# Altium schematic sheet POTENCIA.SchDoc: GESTIÓN DE POTENCIA
size A3; ApprovedBy: ---; Author: MARIO DE MIGUEL; SheetNumber: 3; SheetTotal: 7; ProjectTitle: SENSACIONAL 2
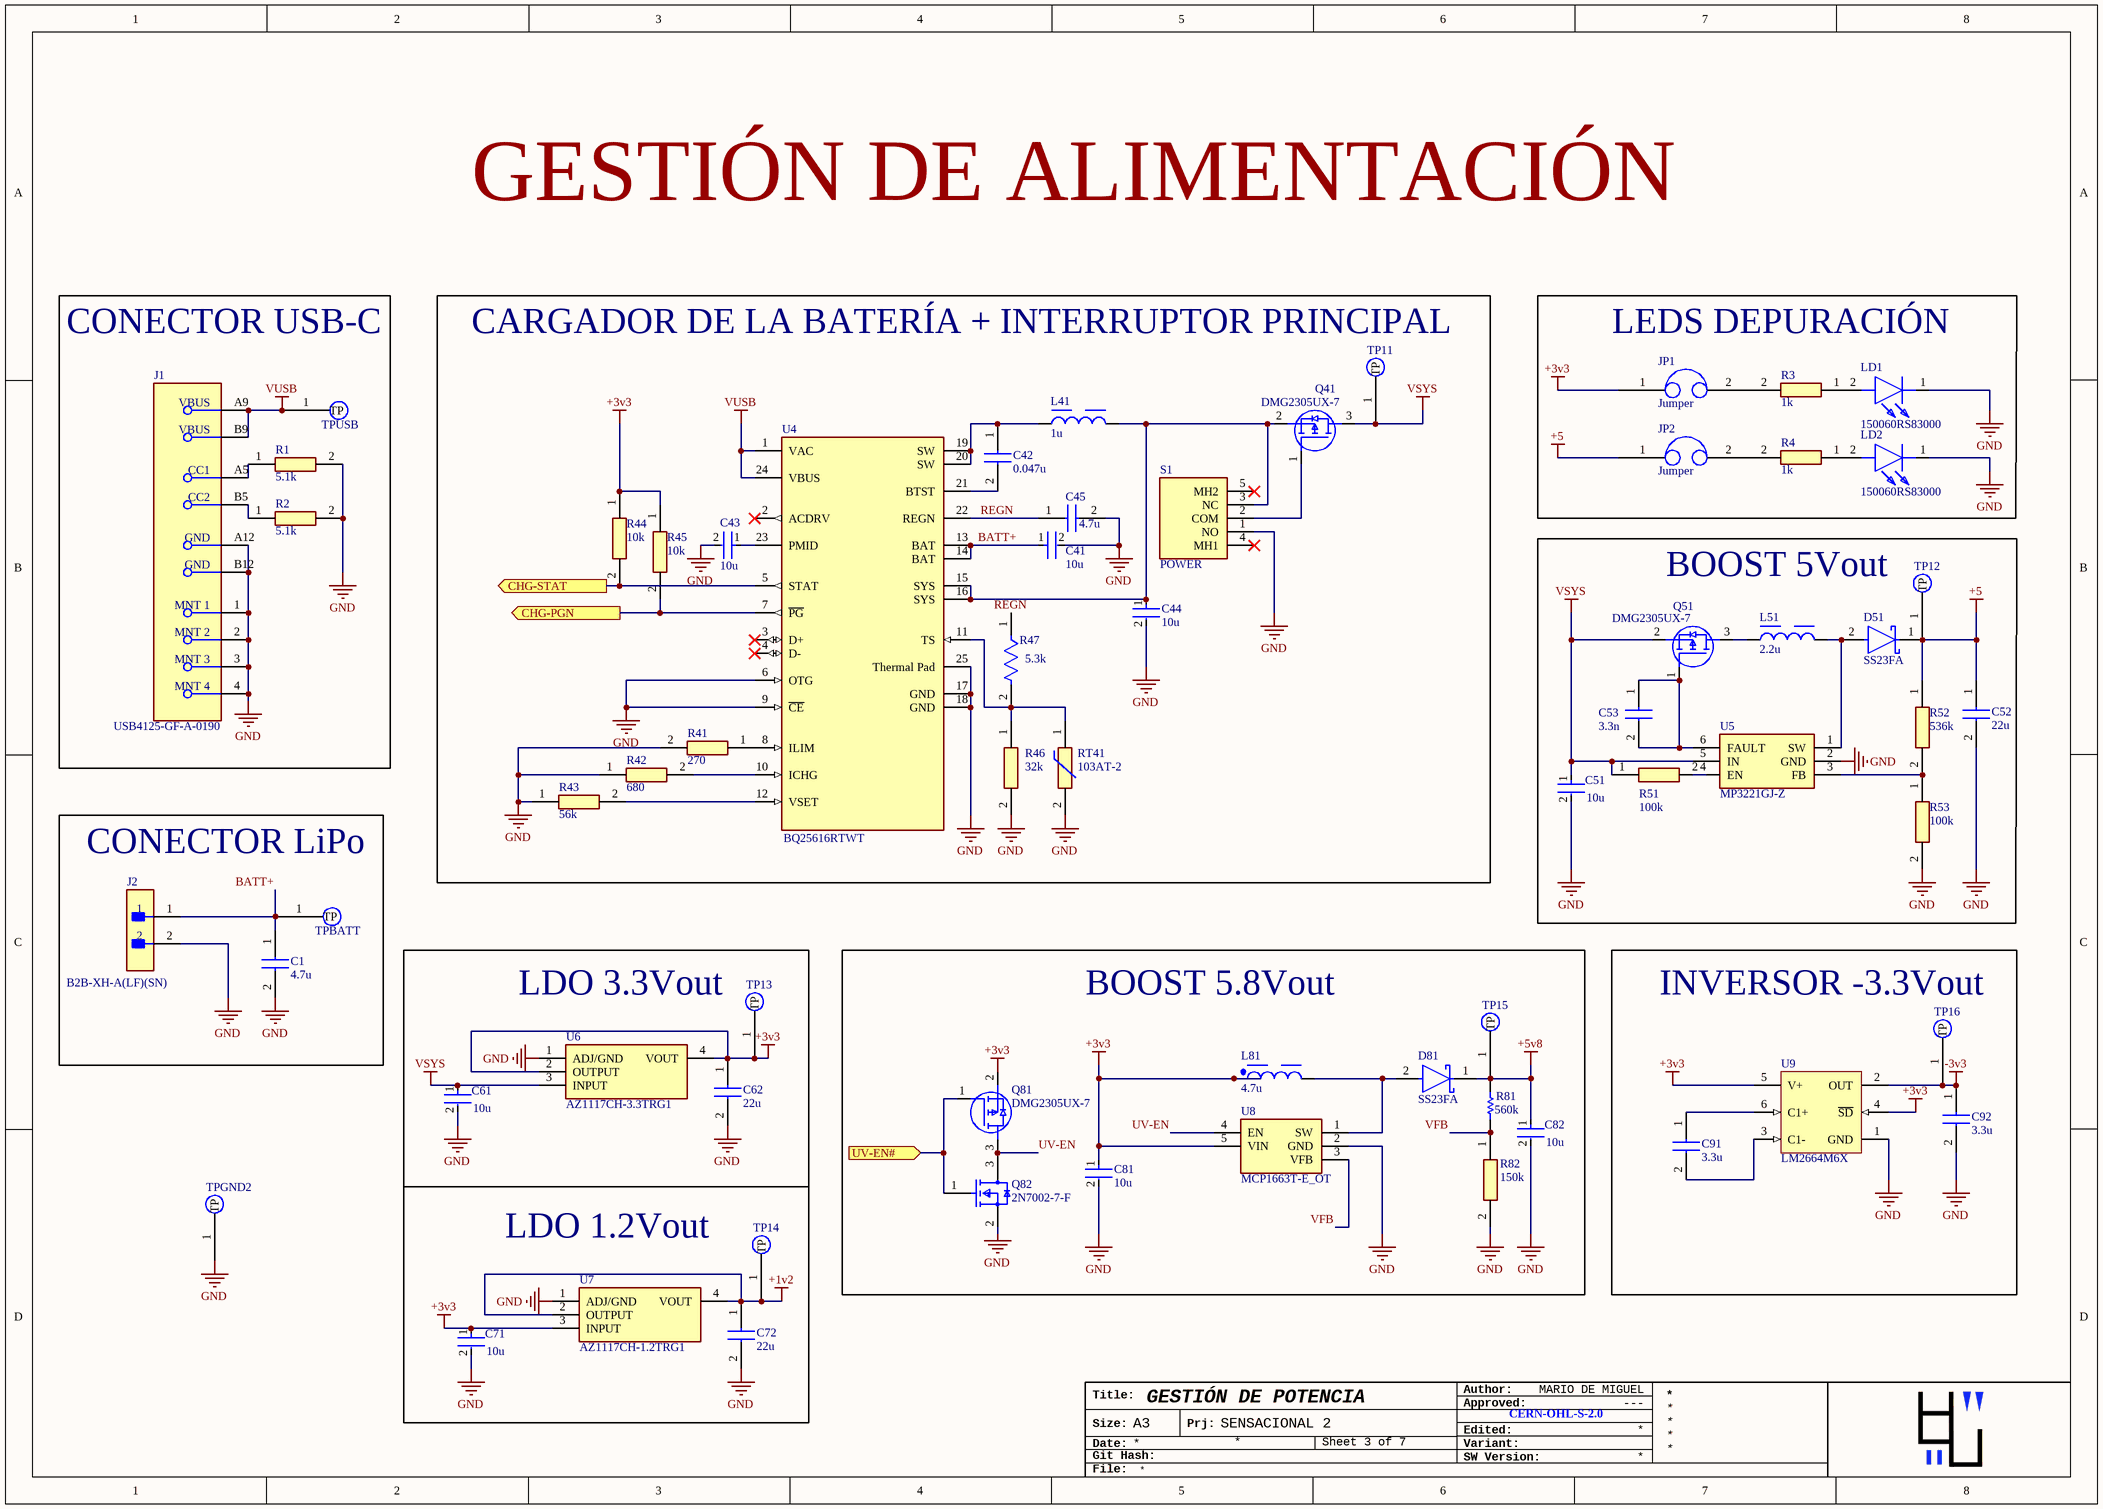
[diagram p0: POTENCIA.SchDoc]

## Parts
C1  4.7u  [C0805]
C41  10u  [FP-C2012-125-0_2-MFG]
C42  0.047u  [CAPC1608X89N]
C43  10u  [FP-C2012-125-0_2-MFG]
C44  10u  [FP-C2012-125-0_2-MFG]
C45  4.7u  [C0805]
C51  10u  [FP-C2012-125-0_2-MFG]
C52  22u  [CAPC3216X200N]
C53  3.3n  [CAPC2012X130N]
C61  10u  [FP-C2012-125-0_2-MFG]
C62  22u  [CAPC3216X200N]
C71  10u  [FP-C2012-125-0_2-MFG]
C72  22u  [CAPC3216X200N]
C81  10u  [FP-C2012-125-0_2-MFG]
C82  10u  [FP-C2012-125-0_2-MFG]
C91  3.3u  [CAPC1608X80N]
C92  3.3u  [CAPC1608X80N]
D51  SS23FA  [FP-425AB-MFG]
D81  SS23FA  [FP-425AB-MFG]
J1  USB4125-GF-A-0190  [FP-USB4125-GF-A-0190-MFG]
J2  B2B-XH-A(LF)(SN)  [FP-B2B-XH-A_LF_SN-MFG]  (no BOM)
JP1  Jumper  [JUMPER_SHUNT]  (no BOM)
JP2  Jumper  [JUMPER_SHUNT]  (no BOM)
L41  1u  [WE-MAPI_3015]
L51  2.2u  [WE-LHMI_4012]
L81  4.7u  [WE-PD_7332]
LD1  150060RS83000  [LEDC1608X95N]
LD2  150060RS83000  [LEDC1608X95N]
Q41  DMG2305UX-7  [SOT96P240X115-3N]
Q51  DMG2305UX-7  [SOT96P240X115-3N]
Q81  DMG2305UX-7  [SOT96P240X115-3N]
Q82  2N7002-7-F  [FP-SOT23-MFG]
R1  5.1k  [RESC1608X55N]
R2  5.1k  [RESC1608X55N]
R3  1k  [ERA6AEB101V]
R4  1k  [ERA6AEB101V]
R41  270  [ERA3AEB101V]
R42  680  [RESC1608X55N]
R43  56k  [ERA3AEB101V]
R44  10k  [RESC1005X40N]
R45  10k  [RESC1005X40N]
R46  32k  [RESC1608X55N]
R47  5.3k  [FP-TNPW0603-e3-MFG]
R51  100k  [ERA3AEB101V]
R52  536k  [RESC1608X55N]
R53  100k  [ERA3AEB101V]
R81  560k  [RESC1608X55X30ML15T15]
R82  150k  [RESC1608X55N]
RT41  103AT-2  [103AT2]  (no BOM)
S1  POWER  [OS102011MS2QS1]  (no BOM)
TP11  Testpoint  [Testpoint_TH]  (value not drawn)  (no BOM)
TP12  Testpoint  [Testpoint_TH]  (value not drawn)  (no BOM)
TP13  Testpoint  [Testpoint_TH]  (value not drawn)  (no BOM)
TP14  Testpoint  [Testpoint_TH]  (value not drawn)  (no BOM)
TP15  Testpoint  [Testpoint_TH]  (value not drawn)  (no BOM)
TP16  Testpoint  [Testpoint_TH]  (value not drawn)  (no BOM)
TPBATT  Testpoint  [Testpoint_TH]  (value not drawn)  (no BOM)
TPGND2  Testpoint  [Testpoint_TH]  (value not drawn)  (no BOM)
TPUSB  Testpoint  [Testpoint_TH]  (value not drawn)  (no BOM)
U4  BQ25616RTWT  [FP-RTW0024H-IPC_B]
U5  MP3221GJ-Z  [SOT95P280X100-6N]
U6  AZ1117CH-3.3TRG1  [SOT230P700X180-4N]
U7  AZ1117CH-1.2TRG1  [SOT230P700X180-4N]
U8  MCP1663T-E_OT  [SOT95P270X145-5N]
U9  LM2664M6X  [DBV0006A_N]

## Blocks framed on the sheet
CONECTOR USB-C: J1 R1 R2 TPUSB
LEDS DEPURACIÓN: JP1 JP2 LD1 LD2 R3 R4
BOOST 5Vout: C51-C53 D51 L51 Q51 R51-R53 TP12 U5
CONECTOR LiPo: C1 J2 TPBATT
LDO 3.3Vout: C61 C62 TP13 U6
BOOST 5.8Vout: C81 C82 D81 L81 Q81 Q82 R81 R82 TP15 U8
INVERSOR -3.3Vout: C91 C92 TP16 U9
LDO 1.2Vout: C71 C72 TP14 U7

## Ports
CHG-PGN (out), CHG-STAT (out), UV-EN# (in)

## Nets
+1v2: C72.1 TP14.1(TP) U7.2(OUTPUT) U7.4(VOUT)
+3v3: C62.1 C71.1 C81.1 JP1.1 L81.1 Q81.2(S) R44.1 R45.1 TP13.1(TP) U6.2(OUTPUT) U6.4(VOUT) U7.3(INPUT) U8.5(VIN) U9.4(~{SD}) U9.5(V+)
+5: C52.1 D51.1(C) JP2.1 R52.1 TP12.1(TP)
+5v8: C82.1 D81.1(C) R81.2 TP15.1(TP)
-3v3: C92.1 TP16.1(TP) U9.2(OUT)
GND: C1.2 C41.2 C43.2 C44.2 C45.2 C51.2 C52.2 C61.2 C62.2 C71.2 C72.2 C81.2 C82.2 C92.2 J1.1(MNT_1) J1.2(MNT_2) J1.3(MNT_3) J1.4(MNT_4) J1.A12(GND) J1.B12(GND) J2.2 LD1.1(K) LD2.1(K) Q82.2(S) R1.2 R2.2 R41.2 R42.1 R43.1 R46.2 R53.2 R82.2 RT41.2 S1.1(NO) TPGND2.1(TP) U4.6(OTG) U4.9(~{CE}) U4.17(GND) U4.18(GND) U4.25(Thermal_Pad) U5.2(GND) U6.1(ADJ/GND) U7.1(ADJ/GND) U8.2(GND) U9.1(GND)
VSYS: C51.1 C61.1 Q41.3(D) Q51.2(S) R51.1 TP11.1(TP) U5.5(IN) U6.3(INPUT)
VUSB: J1.A9(VBUS) J1.B9(VBUS) TPUSB.1(TP) U4.1(VAC) U4.24(VBUS)
BATT+: C1.1 C41.1 J2.1 TPBATT.1(TP) U4.13(BAT) U4.14(BAT)
CHG-PGN: R45.2 U4.7(~{PG}) ; port CHG-PGN
CHG-STAT: R44.2 U4.5(STAT) ; port CHG-STAT
REGN: C45.1 R47.1 U4.22(REGN)
UV-EN: Q81.3(D) Q82.3(D) U8.4(EN)
UV-EN#: Q81.1(G) Q82.1(G) ; port UV-EN#
VFB: R81.1 R82.1 U8.3(VFB)
NetC42_1: C42.1 L41.1 U4.19(SW) U4.20(SW)
NetC42_2: C42.2 U4.21(BTST)
NetC43_1: C43.1 U4.23(PMID)
NetC44_1: C44.1 L41.2 Q41.2(S) S1.3(NC) U4.15(SYS) U4.16(SYS)
NetC53_1: C53.1 C53.2 Q51.1(G) U5.6(FAULT)
NetC91_1: C91.1 U9.6(C1+)
NetC91_2: C91.2 U9.3(C1-)
NetD51_2: D51.2(A) L51.2 U5.1(SW)
NetD81_2: D81.2(A) L81.2 U8.1(SW)
NetJ1_A5: J1.A5(CC1) R1.1
NetJ1_B5: J1.B5(CC2) R2.1
NetJP1_2: JP1.2 R3.2
NetJP2_2: JP2.2 R4.2
NetL51_1: L51.1 Q51.3(D)
NetLD1_2: LD1.2(A) R3.1
NetLD2_2: LD2.2(A) R4.1
NetQ41_1: Q41.1(G) S1.2(COM)
NetR41_1: R41.1 U4.8(ILIM)
NetR42_2: R42.2 U4.10(ICHG)
NetR43_2: R43.2 U4.12(VSET)
NetR46_1: R46.1 R47.2 RT41.1 U4.11(TS)
NetR51_2: R51.2 U5.4(EN)
NetR52_2: R52.2 R53.1 U5.3(FB)

Not connected (* = marked no-connect by the designer): S1 4(MH1)* 5(MH2)*; U4 2(ACDRV)* 3(D+)* 4(D-)*

## Notes on the sheet
- GESTIÓN DE ALIMENTACIÓN
- CARGADOR DE LA BATERÍA + INTERRUPTOR PRINCIPAL
- Title:
- Author:
- Approved:
- Size:
- Date:
- Git Hash:
- A3
- Prj:
- SW Version:
- Variant:
- Edited:
- CERN-OHL-S-2.0
- File:

## Library data of the parts
C1 C45 = C0805X475J8RACAUTO: Capacitor; Manufacturer_Name: KEMET; Datasheet Link: https://content.kemet.com/datasheets/KEM_C1078_X7R_FT-CAP_AUTO_SMD.pdf; Height: 1.1mm; Manufacturer_Part_Number: C0805X475J8RACAUTO; Mouser Part Number: 80-C0805X475J8RAUTO; Mouser Price/Stock: https://www.mouser.co.uk/ProductDetail/KEMET/C0805X475J8RACAUTO?qs=HXFqYaX1Q2zZ0fA5cxYngw%3D%3D; Arrow Part Number: C0805X475J8RACAUTO; Arrow Price/Stock: https://www.arrow.com/en/products/c0805x475j8racauto/kemet-corporation?region=nac
C41 C43 C44 C51 C61 C71 C81 C82 = CMP-2000-05452-2: Multilayer Ceramic Capacitors 10μF ±10% 10V X7R SMD 0805; Capacitance: 10uF; Series: C; Case/Package: 0805; REACH SVHC: No SVHC; Tolerance: 10%; Resistor Type: Ceramic; Termination: SMD/SMT; Weight: 0.000194oz; Depth: 1.25mm; Construction: Flat; RoHS Compliant: Yes; Contact Plating: Tin; Packaging: Tape and Reel; Mount: Surface Mount; Thickness: 0.057inch; Radiation Hardening: No; Dielectric: X7R; Min Operating Temperature: -55°C; Voltage Rating (DC): 10V; Voltage: 10V; Width: 0.049inch; Package Quantity: 1; Number of Pins: 2; Height: 1.25mm; Max Operating Temperature: 125°C; Dielectric Material: Ceramic; Case Code (Imperial): 0805; Lead Free: Lead Free; Voltage Rating: 10V; Case Code (Metric): 2012; Length: 2mm
C42 = KAM15AR71H473KM: Capacitor; Manufacturer_Name: Kyocera AVX; Datasheet Link: https://www.mouser.com/ProductDetail/KYOCERA-AVX/KAM15AR71H473KM?qs=Jm2GQyTW%2Fbirhk%2FTN5CLyw%3D%3D; Height: 0.89mm; Manufacturer_Part_Number: KAM15AR71H473KM; Mouser Part Number: 581-KAM15AR71H473KM; Mouser Price/Stock: https://www.mouser.co.uk/ProductDetail/KYOCERA-AVX/KAM15AR71H473KM?qs=Jm2GQyTW%2Fbirhk%2FTN5CLyw%3D%3D; Arrow Part Number: KAM15AR71H473KM; Arrow Price/Stock: https://www.arrow.com/en/products/kam15ar71h473km/avx?region=nac
C52 C62 C72 = GCJ31CC71C226ME02L: Capacitor; Manufacturer_Name: Murata Electronics; Datasheet Link: https://pim.murata.com/asset/pim4/ceramicCapacitorSMD/GCJ31CC71C226ME02-01A-JP_PDF_CERAMICCAPACITORSMD?lastModifiedDatetime=20250813111307; Height: 2mm; Manufacturer_Part_Number: GCJ31CC71C226ME02L; Arrow Part Number: GCJ31CC71C226ME02L; Arrow Price/Stock: https://www.arrow.com/en/products/gcj31cc71c226me02l/murata-manufacturing?utm_currency=USD&region=nac
C53 = GRM21AR7LU332KW01D: Capacitor; Manufacturer_Name: Murata Electronics; Datasheet Link: https://search.murata.co.jp/Ceramy/image/img/A01X/G101/ENG/GRM21AR7LU332KW01-00B.pdf; Height: 1.3mm; Manufacturer_Part_Number: GRM21AR7LU332KW01D
C91 C92 = C1608X5R1V335K080AC: Capacitor; Manufacturer_Name: TDK; Datasheet Link: https://product.tdk.com/info/en/catalog/datasheets/mlcc_commercial_midvoltage_en.pdf; Height: 0.8mm; Manufacturer_Part_Number: C1608X5R1V335K080AC; Mouser Part Number: 810-C1608X5R1V335KAC; Mouser Price/Stock: https://www.mouser.co.uk/ProductDetail/TDK/C1608X5R1V335K080AC?qs=6JAMGB%252BEdkxQo4ed2qmVpg%3D%3D; Arrow Part Number: C1608X5R1V335K080AC; Arrow Price/Stock: https://www.arrow.com/en/products/c1608x5r1v335k080ac/tdk
D51 D81 = CMP-00278-84331614-1: SS23FA 2 A, 30 V Surface Mount Schottky Barrier Rectifiers; Manufacturer Lifecycle Status: ACTIVE; Max Forward Surge Current (Ifsm): 50A; Max Junction Temperature (Tj): 150°C; Max Repetitive Reverse Voltage (Vrrm): 30V; Peak Reverse Current: 400µA; Element Configuration: Single; Capacitance: 120pF; Average Rectified Current: 2A; Weight: 19mg; Max Operating Temperature: 150°C; NexarPartId: 84331614; Max Reverse Voltage (DC): 30V; Min Operating Temperature: -55°C; Packaging: Cut Tape; Schedule B: 8541100080, 8541100080; RoHS: Compliant; Reverse Voltage: 30V; Mount: Surface Mount; Height: 1.43mm; Forward Current: 2A; Lifecycle Status: Production
J1 = CMP-245163-000004-1: CONN RCPT TYPE C 6P SMD RA
J2 = CMP-2000-05888-3: CONN HEADER VERT 2POS 2.5MM; Current Rating: 3A; Voltage Rating: 250V; Number of Contacts: 2; Contact Resistance: 20mR; Wire/Cable Gauge: 22AWG; Insulation Resistance: 1GR; Connector Type: Male Pin; Packaging: Bulk; Contact Material: Brass; Lead Free: Lead Free; Orientation: Straight; Contact Plating: Tin; Max Current Rating: 3A; Termination: Solder; Fastening Type: Detent; Depth: 5.75mm; Housing Material: Polyamide; REACH SVHC: No SVHC; Series: XH; Voltage Rating (AC): 250V; Number of Positions: 2; Color: Natural; Contact Type: Male Pin; Max Voltage Rating (DC): 250V; Pitch: 2.5mm; Lead Pitch: 2.5mm; Mount: Through Hole; Max Operating Temperature: 85°C; Length: 7.4mm; Max Voltage Rating (AC): 250V; Min Operating Temperature: -25°C; Number of Rows: 1; Housing Color: White
JP1 JP2 = Shunt
L41 = CMP-1393-00020-3: NexarPartId: 30848166; Inductance Tolerance: 20%; Core Material: Composite, Ferrite, Metal; Series Resistance: 39mΩ; Test Frequency: 100kHz; RMS Current (Irms): 2.7A; Inductance: 1µH; Shielding: Shielded; Self Resonant Frequency: 72MHz; Saturation Current: 4.5A; Height: 1.5mm; Packaging: Cut Tape (CT); Ambient Temperature Range High: 85°C; DC Resistance (DCR): 39mΩ; REACH SVHC: Unknown; Case/Package: SMD/SMT; Number of Pins: 2; Case Code (Metric): 3030; Height - Seated (Max): 1.4986mm; Min Operating Temperature: -40°C; Length: 3mm; Tolerance: 20%; Depth: 3mm; Max DC Current: 2.7A; Termination: SMD/SMT; Ambient Temperature Range Low: -40°C; Case Code (Imperial): 1212; Mount: Surface Mount; Width: 3mm; Max Operating Temperature: 125°C; Current Rating: 2.7A; RoHS: Compliant
L51 = CMP-03913-52738373-4: 74437321022 General Purpose Inductor, 2.2uH, 20%, 1 Element, Powdered Iron-Core, SMD, 1816; Inductance: 2.2µH; Saturation Current: 3.2A; Test Frequency: 100kHz; Shielding: Shielded; Current Rating: 2.5A; Core Material: Ferrite; DC Resistance (DCR): 69.2mΩ; Self Resonant Frequency: 55MHz; REACH SVHC: Unknown; Min Operating Temperature: -40°C; Width: 4.06mm; Inductance Tolerance: 20%; Number of Pins: 2; Ambient Temperature Range High: 85°C; Height - Seated (Max): 1.1938mm; Mount: Surface Mount; Height: 1mm; NexarPartId: 52738373; Composition: Wirewound; Length: 4.45mm; RoHS: Compliant; Case/Package: SMD/SMT; RMS Current (Irms): 2.5A; Packaging: Tape & Reel (TR); Ambient Temperature Range Low: -40°C; Max Operating Temperature: 125°C; Tolerance: 20%
L81 = CMP-0227-00124-2: NexarPartId: 23379166; Self Resonant Frequency: 40MHz; Inductance: 4.7µH; Core Material: Ferrite; Inductance Tolerance: 20%; Shielding: Shielded; Max DC Current: 4.2A; Current Rating: 2.32A; DC Resistance (DCR): 42mΩ; Depth: 7.3mm; Packaging: Tape & Reel; Height: 3.2mm; Case/Package: 7332; Number of Pins: 2; Length: 7.3mm; Width: 7.3mm; RoHS: Compliant; Tolerance: 20%; Max Operating Temperature: 125°C; Min Operating Temperature: -40°C; Ambient Temperature Range High: 85°C; Ambient Temperature Range Low: -40°C
LD1 LD2 = 150060RS83000: LED; Manufacturer_Name: Wurth Elektronik; Datasheet Link: https://www.we-online.com/components/products/download/3D_WL-SMCW_150060xx83000+%28rev1%29.pdf; Height: 0.95mm; Manufacturer_Part_Number: 150060RS83000
Q41 Q51 Q81 = DMG2305UX-7: MOSFET (P-Channel); Manufacturer_Name: Diodes Incorporated; Datasheet Link: https://www.diodes.com//assets/Datasheets/DMG2305UX.pdf; Height: 1.15mm; Manufacturer_Part_Number: DMG2305UX-7; Mouser Part Number: 621-DMG2305UX-7; Mouser Price/Stock: https://www.mouser.co.uk/ProductDetail/Diodes-Incorporated/DMG2305UX-7?qs=L1DZKBg7t5F%2FNBHrjfxC%252Bg%3D%3D; Arrow Part Number: DMG2305UX-7; Arrow Price/Stock: https://www.arrow.com/en/products/dmg2305ux-7/diodes-incorporated?utm_currency=USD&region=nac
Q82 = CMP-2000-04929-2: MOSFET N-CH 60V 115MA SOT23-3; Turn-On Delay Time: 7ns; Turn-Off Delay Time: 11ns; Drain to Source Resistance: 7.5R; Rise Time: 3ns; Drain to Source Breakdown Voltage: 70V; Input Capacitance: 50pF; Number of Elements: 1; Power Dissipation: 540mW; Max Power Dissipation: 300mW; Fall Time: 5.6ns; Gate to Source Voltage (Vgs): 20V; Threshold Voltage: 2.5V; Element Configuration: Single; Termination: SMD/SMT; Weight: 0.000282oz; Radiation Hardening: No; Max Operating Temperature: 150°C; On-State Resistance: 7.5R; Mount: Surface Mount; Current Rating: 115mA; Contact Plating: Tin; Lead Free: Lead Free; Min Operating Temperature: -55°C; Number of Pins: 3; REACH SVHC: No SVHC; Drain to Source Voltage (Vdss): 60V; Width: 1.3mm; Package Quantity: 3000; Length: 2.9mm; Case/Package: SOT-23; Number of Channels: 1; Dual Supply Voltage: 60V; Packaging: Tape and Reel; Height: 1mm; Voltage Rating (DC): 60V; Nominal Vgs: 2.5V; Continuous Drain Current (ID): 115mA; Voltage: 60V; Rds On Max: 7.5R
R1 R2 = RC0603FR-075K1L: Resistor; Manufacturer_Name: YAGEO; Datasheet Link: https://www.mouser.mx/datasheet/3/508/1/PYu-AR_51_RoHS_L_7.pdf; Height: 0.55mm; Manufacturer_Part_Number: RC0603FR-075K1L; Mouser Part Number: 603-RC0603FR-075K1L; Mouser Price/Stock: https://www.mouser.co.uk/ProductDetail/YAGEO/RC0603FR-075K1L?qs=gt6vzsuosg2jUUwxnI2PJQ%3D%3D
R3 R4 = ERA-6ARW102V: Resistor; Manufacturer_Name: Panasonic; Datasheet Link: https://industrial.panasonic.com/cdbs/www-data/pdf/RDM0000/AOA0000C307.pdf; Height: 0.6mm; Manufacturer_Part_Number: ERA-6ARW102V; Mouser Part Number: 667-ERA-6ARW102V; Mouser Price/Stock: https://www.mouser.co.uk/ProductDetail/Panasonic/ERA-6ARW102V?qs=ob%252BdNz2%252BYEgF8szbcT859A%3D%3D
R41 = ERA-3AEB271V: Resistor; Manufacturer_Name: Panasonic; Datasheet Link: https://industrial.panasonic.com/cdbs/www-data/pdf/RDM0000/AOA0000C307.pdf; Height: 0.55mm; Manufacturer_Part_Number: ERA-3AEB271V; Mouser Part Number: 667-ERA-3AEB271V; Mouser Price/Stock: https://www.mouser.co.uk/ProductDetail/Panasonic/ERA-3AEB271V?qs=bHJq1HQHzUiYxGxd7delcw%3D%3D; Arrow Part Number: ERA-3AEB271V; Arrow Price/Stock: https://www.arrow.com/en/products/era-3aeb271v/panasonic?utm_currency=USD&region=nac
R42 = CR0603-FX-6800ELF: Resistor; Manufacturer_Name: Bourns; Datasheet Link: https://www.bourns.com/pdfs/chpreztr.pdf; Height: 0.55mm; Manufacturer_Part_Number: CR0603-FX-6800ELF; Mouser Part Number: 652-CR0603FX-6800ELF; Mouser Price/Stock: https://www.mouser.co.uk/ProductDetail/Bourns/CR0603-FX-6800ELF?qs=0nF2VnfAjXlQv%252B4gY05i1Q%3D%3D; Arrow Part Number: CR0603-FX-6800ELF; Arrow Price/Stock: https://www.arrow.com/en/products/cr0603-fx-6800elf/bourns?region=nac
R43 = ERA-3ARB563V: Resistor; Manufacturer_Name: Panasonic; Datasheet Link: https://industrial.panasonic.com/cdbs/www-data/pdf/RDM0000/AOA0000C307.pdf; Height: 0.55mm; Manufacturer_Part_Number: ERA-3ARB563V; Mouser Part Number: 667-ERA-3ARB563V; Mouser Price/Stock: https://www.mouser.co.uk/ProductDetail/Panasonic/ERA-3ARB563V?qs=ob%252BdNz2%252BYEjUxBvjNQsa6g%3D%3D
R44 R45 = RCA040210K0JNED: Resistor; Manufacturer_Name: Vishay; Datasheet Link: https://www.vishay.com/docs/20037/rcae3.pdf; Height: 0.4mm; Manufacturer_Part_Number: RCA040210K0JNED; Mouser Part Number: 71-RCA040210K0JNED; Mouser Price/Stock: https://www.mouser.co.uk/ProductDetail/Vishay-Draloric/RCA040210K0JNED?qs=MG8z16zmaH46yN0G7Zhn3Q%3D%3D; Arrow Part Number: RCA040210K0JNED; Arrow Price/Stock: https://www.arrow.com/en/products/rca040210k0jned/vishay?region=nac
R46 = RT0603BRD0732KL: Resistor; Manufacturer_Name: YAGEO; Datasheet Link: https://www.mouser.com/datasheet/3/508/1/PYu-RT_1-to-0.01_RoHS_L_15.pdf; Height: 0.55mm; Manufacturer_Part_Number: RT0603BRD0732KL; Mouser Part Number: 603-RT0603BRD0732KL; Mouser Price/Stock: https://www.mouser.co.uk/ProductDetail/YAGEO/RT0603BRD0732KL?qs=bQfrgN9vNvx59w0%252BvAxCSQ%3D%3D; Arrow Part Number: RT0603BRD0732KL; Arrow Price/Stock: https://www.arrow.com/en/products/rt0603brd0732kl/yageo?region=nac
R47 = CMP-02407-009580-1: RES 5.3K OHM 0.1% 1/10W 0603; Resistance: 5.3kR; Voltage Rating: 75V; Power Rating: 100mW; Voltage Rating (DC): 50V; Temperature Coefficient: 25ppm/°C; Weight: 7.1E-05oz; Composition: Thin Film; Features: Moisture Resistant; Termination: SMD/SMT; Tolerance: 0.1%; Packaging: Tape and Reel; Min Operating Temperature: -55°C; Case Code (Metric): 1608; Length: 0.063inch; Max Operating Temperature: 125°C; Case Code (Imperial): 0603; Height: 0.022inch; Contact Plating: Tin; Case/Package: 0603; Number of Terminations: 2; Width: 0.8mm; Max Power Dissipation: 100mW
R51 R53 = ERA-3AED104V: Resistor; Manufacturer_Name: Panasonic; Datasheet Link: https://industrial.panasonic.com/cdbs/www-data/pdf/RDM0000/AOA0000C307.pdf; Height: 0.55mm; Manufacturer_Part_Number: ERA-3AED104V; Mouser Part Number: 667-ERA-3AED104V; Mouser Price/Stock: https://www.mouser.co.uk/ProductDetail/Panasonic/ERA-3AED104V?qs=MNPzkKEzRtQIWcmUWL4kjg%3D%3D; Arrow Part Number: ERA-3AED104V; Arrow Price/Stock: https://www.arrow.com/en/products/era-3aed104v/panasonic?utm_currency=USD&region=europe
R52 = ERJ-3EKF5363V: Resistor; Manufacturer_Name: Panasonic; Datasheet Link: http://industrial.panasonic.com/cdbs/www-data/pdf/RDA0000/AOA0000C86.pdf; Height: 0.55mm; Manufacturer_Part_Number: ERJ-3EKF5363V; Mouser Part Number: 667-ERJ-3EKF5363V; Mouser Price/Stock: https://www.mouser.com/Search/Refine.aspx?Keyword=667-ERJ-3EKF5363V
R81 = CMP-2000-00811-1: Manufacturer: Panasonic; Part Number: ERJ-3GEYJ564V
R82 = ERJ-S03J154V: Resistor; Manufacturer_Name: Panasonic; Datasheet Link: https://industrial.panasonic.com/cdbs/www-data/pdf/RDP0000/AOA0000C334.pdf; Height: 0.55mm; Manufacturer_Part_Number: ERJ-S03J154V; Mouser Part Number: 667-ERJ-S03J154V; Mouser Price/Stock: https://www.mouser.co.uk/ProductDetail/Panasonic/ERJ-S03J154V?qs=Zyl8A9hlmJq5GQJzf8bNAA%3D%3D
RT41 = 103AT-2: Thermistor; Manufacturer_Name: Semitec; Datasheet Link: https://www.semitec-global.com/uploads/2022/01/P12-13-AT-Thermistor.pdf; Height: 9.5mm; Manufacturer_Part_Number: 103AT-2; Mouser Part Number: 954-103AT-2; Mouser Price/Stock: https://www.mouser.co.uk/ProductDetail/Semitec/103AT-2?qs=wgO0AD0o1vvcDzsKguD%252Bew%3D%3D
S1 = OS102011MS2QS1: Switch; Manufacturer_Name: C & K COMPONENTS; Datasheet Link: https://www.ckswitches.com/media/1428/os.pdf; Height: 8mm; Manufacturer_Part_Number: OS102011MS2QS1; Mouser Part Number: 611-OS102011MS2QS1; Mouser Price/Stock: https://www.mouser.co.uk/ProductDetail/CK/OS102011MS2QS1?qs=WtljUlYws5TrGs9OfHrZYw%3D%3D; Arrow Part Number: OS102011MS2QS1; Arrow Price/Stock: https://www.arrow.com/en/products/os102011ms2qs1/ck?utm_currency=USD&region=nac
U4 = CMP-04911-000062-1: BQ25616RTWR/T
U5 = MP3221GJ-Z: Integrated Circuit; Manufacturer_Name: Monolithic Power Systems (MPS); Datasheet Link: https://www.monolithicpower.com/pub/media/document/MP3221_r1.0.pdf; Height: 1mm; Manufacturer_Part_Number: MP3221GJ-Z; Mouser Part Number: 946-MP3221GJ-Z; Mouser Price/Stock: https://www.mouser.co.uk/ProductDetail/Monolithic-Power-Systems-MPS/MP3221GJ-Z?qs=%252BZix9lVCYc8HxaXdJpHAOw%3D%3D
U6 = AZ1117CH-3.3TRG1: Integrated Circuit; Manufacturer_Name: Diodes Incorporated; Datasheet Link: https://www.diodes.com//assets/Datasheets/AZ1117C.pdf; Height: 1.8mm; Manufacturer_Part_Number: AZ1117CH-3.3TRG1; Mouser Part Number: 621-AZ1117CH-3.3TRG1; Mouser Price/Stock: https://www.mouser.co.uk/ProductDetail/Diodes-Incorporated/AZ1117CH-3.3TRG1?qs=FKu9oBikfSm7ntaG6olPSQ%3D%3D; Arrow Part Number: AZ1117CH-3.3TRG1; Arrow Price/Stock: https://www.arrow.com/en/products/az1117ch-3.3trg1/diodes-incorporated?utm_currency=USD&region=nac
U7 = AZ1117CH-1.2TRG1: Integrated Circuit; Manufacturer_Name: Diodes Incorporated; Datasheet Link: https://www.diodes.com//assets/Datasheets/AZ1117C.pdf; Height: 1.8mm; Manufacturer_Part_Number: AZ1117CH-1.2TRG1; Mouser Part Number: 621-AZ1117CH-1.2TRG1; Mouser Price/Stock: https://www.mouser.co.uk/ProductDetail/Diodes-Incorporated/AZ1117CH-1.2TRG1?qs=FKu9oBikfSlZ9PNPPvaC2Q%3D%3D; Arrow Part Number: AZ1117CH-1.2TRG1; Arrow Price/Stock: https://www.arrow.com/en/products/az1117ch-1.2trg1/diodes-incorporated?utm_currency=USD&region=nac
U8 = MCP1663T-E_OT: Integrated Circuit; Manufacturer_Name: Microchip; Manufacturer_Part_Number: MCP1663T-E/OT; Datasheet Link: https://mouser.componentsearchengine.com/Datasheets/1/MCP1663T-E_OT.pdf; Height: 1.45mm; Mouser Part Number: 579-MCP1663T-E/OT; Mouser Price/Stock: https://www.mouser.co.uk/ProductDetail/Microchip-Technology/MCP1663T-E-OT?qs=U5tD5cY1XDxnrZZotnnVrg%3D%3D; Arrow Part Number: MCP1663T-E/OT; Arrow Price/Stock: https://www.arrow.com/en/products/mcp1663t-eot/microchip-technology?region=nac
U9 = CMP-0065-00075-3: Switched Capacitor Voltage Converter, 6-pin SOT-23; Manufacturer: Texas Instruments; PackageTopMarking: S03A*XTT; CompType: Switch Caps; PowerWise: N; ComponentLink1Description: Datasheet URL; PinCount: 6; Code_JEDEC: MO-178-AB; PackageDescription: Molded SOT-23, .115 x .063 x .040in Body, 6 Lead, .0375in in Pitch; Code_IPC: SOT26A-6; PackageReference: DBV0006A; ComponentLink1URL: http://www.ti.com/general/docs/lit/getliterature.tsp?genericPartNumber=LM2664&fileType=pdf; RoHS: N